# Altium schematic sheet ADC.SchDoc
size A4
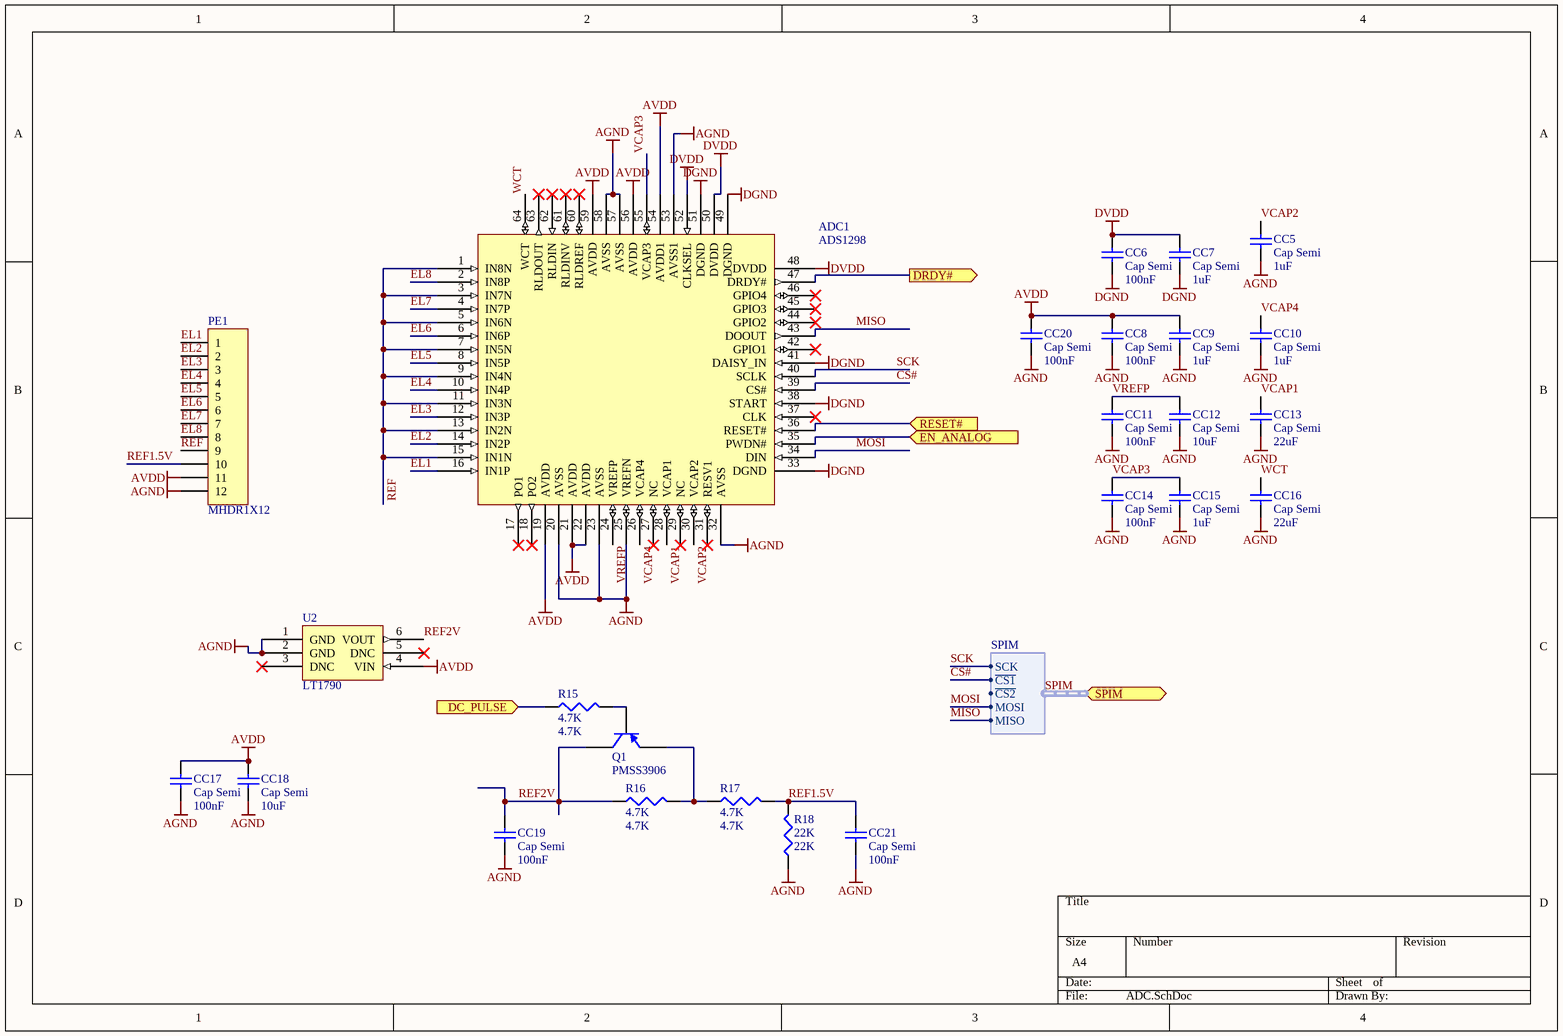
[diagram p0: ADC.SchDoc]

## Parts
ADC1  ADS1298  [LQFP64_M]
CC5  Cap Semi  value 1uF  [0402]
CC6  Cap Semi  value 100nF  [0402]
CC7  Cap Semi  value 1uF  [0402]
CC8  Cap Semi  value 100nF  [0402]
CC9  Cap Semi  value 1uF  [0402]
CC10  Cap Semi  value 1uF  [0402]
CC11  Cap Semi  value 100nF  [0402]
CC12  Cap Semi  value 10uF  [0402]
CC13  Cap Semi  value 22uF  [0402]
CC14  Cap Semi  value 100nF  [0402]
CC15  Cap Semi  value 1uF  [0402]
CC16  Cap Semi  value 22uF  [1608[0603]]
CC17  Cap Semi  value 100nF  [0402]
CC18  Cap Semi  value 10uF  [0402]
CC19  Cap Semi  value 100nF  [0402]
CC20  Cap Semi  value 100nF  [0402]
CC21  Cap Semi  value 100nF  [0402]
PE1  MHDR1X12  [HEADER12]
Q1  PMSS3906  [SOT323_N]
R15  4.7K  [0402]
R16  4.7K  [0402]
R17  4.7K  [0402]
R18  22K  [0402]
U2  LT1790  [SOT-23_A_N]

## Ports
DC_PULSE (in), DRDY# (out), EN_ANALOG (in), RESET# (in), SPIM (harness SPIM)

## Harnesses
SPIM: SCK, ~{CS1}, ~{CS2}, MOSI, MISO

## Nets
AGND: ADC1.20(AVSS) ADC1.23(AVSS) ADC1.25(VREFN) ADC1.32(AVSS) ADC1.53(AVSS1) ADC1.57(AVSS) ADC1.58(AVSS) CC5.1 CC8.1 CC9.1 CC10.1 CC11.1 CC12.1 CC13.1 CC14.1 CC15.1 CC16.1 CC17.1 CC18.1 CC19.1 CC20.1 CC21.1 PE1.12 R18.1 U2.1(GND) U2.2(GND)
AVDD: ADC1.19(AVDD) ADC1.21(AVDD) ADC1.22(AVDD) ADC1.54(AVDD1) ADC1.56(AVDD) ADC1.59(AVDD) CC8.2 CC9.2 CC17.2 CC18.2 CC20.2 PE1.11 U2.4(VIN)
DGND: ADC1.33(DGND) ADC1.38(START) ADC1.41(DAISY_IN) ADC1.49(DGND) ADC1.51(DGND) CC6.1 CC7.1
DVDD: ADC1.48(DVDD) ADC1.50(DVDD) ADC1.52(CLKSEL) CC6.2 CC7.2
CS#: ADC1.39(CS#) ; port SPIM.~{CS1}
DC_PULSE: R15.1 ; port DC_PULSE
DRDY#: ADC1.47(DRDY#) ; port DRDY#
EL1: ADC1.16(IN1P) PE1.1
EL2: ADC1.14(IN2P) PE1.2
EL3: ADC1.12(IN3P) PE1.3
EL4: ADC1.10(IN4P) PE1.4
EL5: ADC1.8(IN5P) PE1.5
EL6: ADC1.6(IN6P) PE1.6
EL7: ADC1.4(IN7P) PE1.7
EL8: ADC1.2(IN8P) PE1.8
EN_ANALOG: ADC1.35(PWDN#) ; port EN_ANALOG
MISO: ADC1.43(DOOUT) ; port SPIM.MISO
MOSI: ADC1.34(DIN) ; port SPIM.MOSI
REF: ADC1.1(IN8N) ADC1.3(IN7N) ADC1.5(IN6N) ADC1.7(IN5N) ADC1.9(IN4N) ADC1.11(IN3N) ADC1.13(IN2N) ADC1.15(IN1N) PE1.9
REF1.5V: CC21.2 PE1.10 R17.2 R18.2
REF2V: CC19.2 Q1.3(C) R16.1 U2.6(VOUT)
RESET#: ADC1.36(RESET#) ; port RESET#
SCK: ADC1.40(SCLK) ; port SPIM.SCK
VCAP1: ADC1.28(VCAP1) CC13.2
VCAP2: ADC1.30(VCAP2) CC5.2
VCAP3: ADC1.55(VCAP3) CC14.2 CC15.2
VCAP4: ADC1.26(VCAP4) CC10.2
VREFP: ADC1.24(VREFP) CC11.2 CC12.2
WCT: ADC1.64(WCT) CC16.2
NetQ1_1: Q1.1(B) R15.2
NetQ1_2: Q1.2(E) R16.2 R17.1

Not connected (* = marked no-connect by the designer): ADC1 17(PO1)* 18(PO2)* 27(NC)* 29(NC)* 31(RESV1)* 37(CLK)* 42(GPIO1)* 44(GPIO2)* 45(GPIO3)* 46(GPIO4)* 60(RLDREF)* 61(RLDINV)* 62(RLDIN)* 63(RLDOUT)*; U2 3(DNC)* 5(DNC)*

## Buses and harness runs
harness SPIM = port SPIM

## Library data of the parts
CC5-CC21 = Cap Semi: Capacitor (Semiconductor SIM Model); Published: 8-Jun-2000; LatestRevisionDate: 29-May-2009; LatestRevisionNote: IPC-7351 Footprint Added.; PackageReference: C1206; Publisher: Altium Limited; PackageDescription: Chip Capacitor
PE1 = MHDR1X12: Header, 12-Pin; LatestRevisionDate: 17-Jul-2002; LatestRevisionNote: Re-released for DXP Platform.; Publisher: Altium Limited
Q1 = PMSS3906: PNP Switching Transistor; Published: 17-Sep-2003; LatestRevisionDate: 12-Dec-2006; LatestRevisionNote: IPC-7351 Footprint Added.; DatasheetVersion: 22-Apr-1999; PackageVersion: Apr-1999; PackageReference: SOT323; Publisher: Altium Limited; PackageDescription: 3-Pin SOT-323 Package 0.65 mm Pitch, 2.1 mm Lead Span; ComponentLink1Description: Manufacturer Link; ComponentLink1URL: http://www.semiconductors.philips.com/; ComponentLink2Description: Datasheet; ComponentLink2URL: http://www.semiconductors.philips.com/acrobat/datasheets/PMSS3906_4.pdf
R15-R18 = Res3: Resistor; Published: 8-Jun-2000; LatestRevisionDate: 29-May-2009; LatestRevisionNote: IPC-7351 Footprint Added.; PackageReference: J1-0603; Publisher: Altium Limited; PackageDescription: Chip Resistor
  R15-R17: Value: 4.7K
  R18: Value: 22K